# Altium schematic sheet MCH_CON.SchDoc: Metlino
size 420 x 297 mm; CheckedBy: P.Kulik,T.Przywozki,W.Ruclo; Author: G.Kasprowicz; CompanyName: WUT ISE; DrawnBy: G.Kasprowicz; Organization: WUT ISE; Address1: PW ISE; Address2: Nowowiejska 15/19 00-665 Warsaw; Address3: gkasprow@gmail.com; DocumentNumber: 15; Revision: 2; SheetNumber: 15; SheetTotal: 29; ModifiedBy: -; CheckedDate: -; Title2: MCH Tongue 3&4 connectors; DivGrp: WUT ISE; Designer: G.Kasprowicz; ModifiedDate: -; ProjectName: Sensor Box
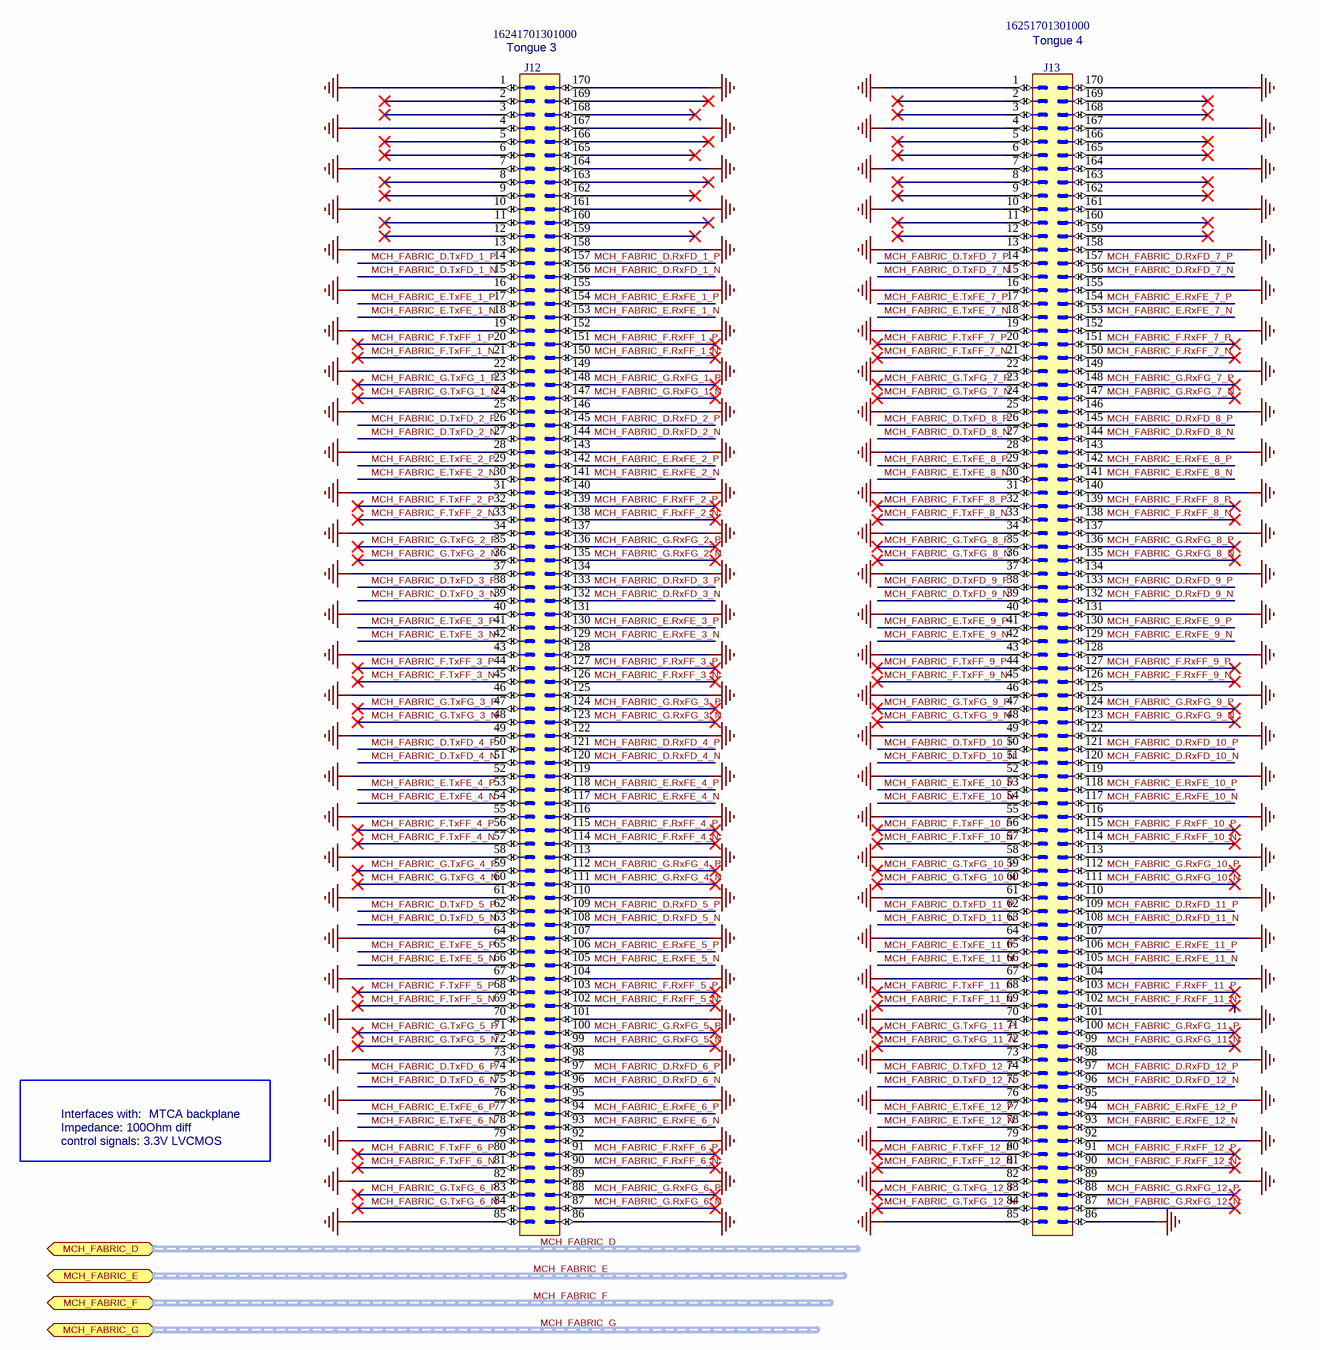
[diagram p0: MCH_CON.SchDoc]

## Parts
J12  Manufacturer Part Number: 16241701301000  [ITB_16241701301000]  (hidden comment: AdvancedMC)
J13  Manufacturer Part Number: 16251701301000  [ITB_16251701301000]  (hidden comment: AdvancedMC)

## Ports
MCH_FABRIC_D (bidir, harness MCH_FABRIC_D), MCH_FABRIC_E (bidir, harness MCH_FABRIC_E), MCH_FABRIC_F (bidir, harness MCH_FABRIC_F), MCH_FABRIC_G (bidir, harness MCH_FABRIC_G)

## Nets
GND: J12.1 J12.4 J12.7 J12.10 J12.13 J12.16 J12.19 J12.22 J12.25 J12.28 J12.31 J12.34 J12.37 J12.40 J12.43 J12.46 J12.49 J12.52 J12.55 J12.58 J12.61 J12.64 J12.67 J12.70 J12.73 J12.76 J12.79 J12.82 J12.85 J12.86 J12.89 J12.92 J12.95 J12.98 J12.101 J12.104 J12.107 J12.110 J12.113 J12.116 J12.119 J12.122 J12.125 J12.128 J12.131 J12.134 J12.137 J12.140 J12.143 J12.146 J12.149 J12.152 J12.155 J12.158 J12.161 J12.164 J12.167 J12.170 J13.1 J13.4 J13.7 J13.10 J13.13 J13.16 J13.19 J13.22 J13.25 J13.28 J13.31 J13.34 J13.37 J13.40 J13.43 J13.46 J13.49 J13.52 J13.55 J13.58 J13.61 J13.64 J13.67 J13.70 J13.73 J13.76 J13.79 J13.82 J13.85 J13.86 J13.89 J13.92 J13.95 J13.98 J13.101 J13.104 J13.107 J13.110 J13.113 J13.116 J13.119 J13.122 J13.125 J13.128 J13.131 J13.134 J13.137 J13.140 J13.143 J13.146 J13.149 J13.152 J13.155 J13.158 J13.161 J13.164 J13.167 J13.170
MCH_FABRIC_D.RxFD_1_N: J12.156
MCH_FABRIC_D.RxFD_1_P: J12.157
MCH_FABRIC_D.RxFD_2_N: J12.144
MCH_FABRIC_D.RxFD_2_P: J12.145
MCH_FABRIC_D.RxFD_3_N: J12.132
MCH_FABRIC_D.RxFD_3_P: J12.133
MCH_FABRIC_D.RxFD_4_N: J12.120
MCH_FABRIC_D.RxFD_4_P: J12.121
MCH_FABRIC_D.RxFD_5_N: J12.108
MCH_FABRIC_D.RxFD_5_P: J12.109
MCH_FABRIC_D.RxFD_6_N: J12.96
MCH_FABRIC_D.RxFD_6_P: J12.97
MCH_FABRIC_D.RxFD_7_N: J13.156
MCH_FABRIC_D.RxFD_7_P: J13.157
MCH_FABRIC_D.RxFD_8_N: J13.144
MCH_FABRIC_D.RxFD_8_P: J13.145
MCH_FABRIC_D.RxFD_9_N: J13.132
MCH_FABRIC_D.RxFD_9_P: J13.133
MCH_FABRIC_D.RxFD_10_N: J13.120
MCH_FABRIC_D.RxFD_10_P: J13.121
MCH_FABRIC_D.RxFD_11_N: J13.108
MCH_FABRIC_D.RxFD_11_P: J13.109
MCH_FABRIC_D.RxFD_12_N: J13.96
MCH_FABRIC_D.RxFD_12_P: J13.97
MCH_FABRIC_D.TxFD_1_N: J12.15
MCH_FABRIC_D.TxFD_1_P: J12.14
MCH_FABRIC_D.TxFD_2_N: J12.27
MCH_FABRIC_D.TxFD_2_P: J12.26
MCH_FABRIC_D.TxFD_3_N: J12.39
MCH_FABRIC_D.TxFD_3_P: J12.38
MCH_FABRIC_D.TxFD_4_N: J12.51
MCH_FABRIC_D.TxFD_4_P: J12.50
MCH_FABRIC_D.TxFD_5_N: J12.63
MCH_FABRIC_D.TxFD_5_P: J12.62
MCH_FABRIC_D.TxFD_6_N: J12.75
MCH_FABRIC_D.TxFD_6_P: J12.74
MCH_FABRIC_D.TxFD_7_N: J13.15
MCH_FABRIC_D.TxFD_7_P: J13.14
MCH_FABRIC_D.TxFD_8_N: J13.27
MCH_FABRIC_D.TxFD_8_P: J13.26
MCH_FABRIC_D.TxFD_9_N: J13.39
MCH_FABRIC_D.TxFD_9_P: J13.38
MCH_FABRIC_D.TxFD_10_N: J13.51
MCH_FABRIC_D.TxFD_10_P: J13.50
MCH_FABRIC_D.TxFD_11_N: J13.63
MCH_FABRIC_D.TxFD_11_P: J13.62
MCH_FABRIC_D.TxFD_12_N: J13.75
MCH_FABRIC_D.TxFD_12_P: J13.74
MCH_FABRIC_E.RxFE_1_N: J12.153
MCH_FABRIC_E.RxFE_1_P: J12.154
MCH_FABRIC_E.RxFE_2_N: J12.141
MCH_FABRIC_E.RxFE_2_P: J12.142
MCH_FABRIC_E.RxFE_3_N: J12.129
MCH_FABRIC_E.RxFE_3_P: J12.130
MCH_FABRIC_E.RxFE_4_N: J12.117
MCH_FABRIC_E.RxFE_4_P: J12.118
MCH_FABRIC_E.RxFE_5_N: J12.105
MCH_FABRIC_E.RxFE_5_P: J12.106
MCH_FABRIC_E.RxFE_6_N: J12.93
MCH_FABRIC_E.RxFE_6_P: J12.94
MCH_FABRIC_E.RxFE_7_N: J13.153
MCH_FABRIC_E.RxFE_7_P: J13.154
MCH_FABRIC_E.RxFE_8_N: J13.141
MCH_FABRIC_E.RxFE_8_P: J13.142
MCH_FABRIC_E.RxFE_9_N: J13.129
MCH_FABRIC_E.RxFE_9_P: J13.130
MCH_FABRIC_E.RxFE_10_N: J13.117
MCH_FABRIC_E.RxFE_10_P: J13.118
MCH_FABRIC_E.RxFE_11_N: J13.105
MCH_FABRIC_E.RxFE_11_P: J13.106
MCH_FABRIC_E.RxFE_12_N: J13.93
MCH_FABRIC_E.RxFE_12_P: J13.94
MCH_FABRIC_E.TxFE_1_N: J12.18
MCH_FABRIC_E.TxFE_1_P: J12.17
MCH_FABRIC_E.TxFE_2_N: J12.30
MCH_FABRIC_E.TxFE_2_P: J12.29
MCH_FABRIC_E.TxFE_3_N: J12.42
MCH_FABRIC_E.TxFE_3_P: J12.41
MCH_FABRIC_E.TxFE_4_N: J12.54
MCH_FABRIC_E.TxFE_4_P: J12.53
MCH_FABRIC_E.TxFE_5_N: J12.66
MCH_FABRIC_E.TxFE_5_P: J12.65
MCH_FABRIC_E.TxFE_6_N: J12.78
MCH_FABRIC_E.TxFE_6_P: J12.77
MCH_FABRIC_E.TxFE_7_N: J13.18
MCH_FABRIC_E.TxFE_7_P: J13.17
MCH_FABRIC_E.TxFE_8_N: J13.30
MCH_FABRIC_E.TxFE_8_P: J13.29
MCH_FABRIC_E.TxFE_9_N: J13.42
MCH_FABRIC_E.TxFE_9_P: J13.41
MCH_FABRIC_E.TxFE_10_N: J13.54
MCH_FABRIC_E.TxFE_10_P: J13.53
MCH_FABRIC_E.TxFE_11_N: J13.66
MCH_FABRIC_E.TxFE_11_P: J13.65
MCH_FABRIC_E.TxFE_12_N: J13.78
MCH_FABRIC_E.TxFE_12_P: J13.77
MCH_FABRIC_F.RxFF_1_N: J12.150
MCH_FABRIC_F.RxFF_1_P: J12.151
MCH_FABRIC_F.RxFF_2_N: J12.138
MCH_FABRIC_F.RxFF_2_P: J12.139
MCH_FABRIC_F.RxFF_3_N: J12.126
MCH_FABRIC_F.RxFF_3_P: J12.127
MCH_FABRIC_F.RxFF_4_N: J12.114
MCH_FABRIC_F.RxFF_4_P: J12.115
MCH_FABRIC_F.RxFF_5_N: J12.102
MCH_FABRIC_F.RxFF_5_P: J12.103
MCH_FABRIC_F.RxFF_6_N: J12.90
MCH_FABRIC_F.RxFF_6_P: J12.91
MCH_FABRIC_F.RxFF_7_N: J13.150
MCH_FABRIC_F.RxFF_7_P: J13.151
MCH_FABRIC_F.RxFF_8_N: J13.138
MCH_FABRIC_F.RxFF_8_P: J13.139
MCH_FABRIC_F.RxFF_9_N: J13.126
MCH_FABRIC_F.RxFF_9_P: J13.127
MCH_FABRIC_F.RxFF_10_N: J13.114
MCH_FABRIC_F.RxFF_10_P: J13.115
MCH_FABRIC_F.RxFF_11_N: J13.102
MCH_FABRIC_F.RxFF_11_P: J13.103
MCH_FABRIC_F.RxFF_12_N: J13.90
MCH_FABRIC_F.RxFF_12_P: J13.91
MCH_FABRIC_F.TxFF_1_N: J12.21
MCH_FABRIC_F.TxFF_1_P: J12.20
MCH_FABRIC_F.TxFF_2_N: J12.33
MCH_FABRIC_F.TxFF_2_P: J12.32
MCH_FABRIC_F.TxFF_3_N: J12.45
MCH_FABRIC_F.TxFF_3_P: J12.44
MCH_FABRIC_F.TxFF_4_N: J12.57
MCH_FABRIC_F.TxFF_4_P: J12.56
MCH_FABRIC_F.TxFF_5_N: J12.69
MCH_FABRIC_F.TxFF_5_P: J12.68
MCH_FABRIC_F.TxFF_6_N: J12.81
MCH_FABRIC_F.TxFF_6_P: J12.80
MCH_FABRIC_F.TxFF_7_N: J13.21
MCH_FABRIC_F.TxFF_7_P: J13.20
MCH_FABRIC_F.TxFF_8_N: J13.33
MCH_FABRIC_F.TxFF_8_P: J13.32
MCH_FABRIC_F.TxFF_9_N: J13.45
MCH_FABRIC_F.TxFF_9_P: J13.44
MCH_FABRIC_F.TxFF_10_N: J13.57
MCH_FABRIC_F.TxFF_10_P: J13.56
MCH_FABRIC_F.TxFF_11_N: J13.69
MCH_FABRIC_F.TxFF_11_P: J13.68
MCH_FABRIC_F.TxFF_12_N: J13.81
MCH_FABRIC_F.TxFF_12_P: J13.80
MCH_FABRIC_G.RxFG_1_N: J12.147
MCH_FABRIC_G.RxFG_1_P: J12.148
MCH_FABRIC_G.RxFG_2_N: J12.135
MCH_FABRIC_G.RxFG_2_P: J12.136
MCH_FABRIC_G.RxFG_3_N: J12.123
MCH_FABRIC_G.RxFG_3_P: J12.124
MCH_FABRIC_G.RxFG_4_N: J12.111
MCH_FABRIC_G.RxFG_4_P: J12.112
MCH_FABRIC_G.RxFG_5_N: J12.99
MCH_FABRIC_G.RxFG_5_P: J12.100
MCH_FABRIC_G.RxFG_6_N: J12.87
MCH_FABRIC_G.RxFG_6_P: J12.88
MCH_FABRIC_G.RxFG_7_N: J13.147
MCH_FABRIC_G.RxFG_7_P: J13.148
MCH_FABRIC_G.RxFG_8_N: J13.135
MCH_FABRIC_G.RxFG_8_P: J13.136
MCH_FABRIC_G.RxFG_9_N: J13.123
MCH_FABRIC_G.RxFG_9_P: J13.124
MCH_FABRIC_G.RxFG_10_N: J13.111
MCH_FABRIC_G.RxFG_10_P: J13.112
MCH_FABRIC_G.RxFG_11_N: J13.99
MCH_FABRIC_G.RxFG_11_P: J13.100
MCH_FABRIC_G.RxFG_12_N: J13.87
MCH_FABRIC_G.RxFG_12_P: J13.88
MCH_FABRIC_G.TxFG_1_N: J12.24
MCH_FABRIC_G.TxFG_1_P: J12.23
MCH_FABRIC_G.TxFG_2_N: J12.36
MCH_FABRIC_G.TxFG_2_P: J12.35
MCH_FABRIC_G.TxFG_3_N: J12.48
MCH_FABRIC_G.TxFG_3_P: J12.47
MCH_FABRIC_G.TxFG_4_N: J12.60
MCH_FABRIC_G.TxFG_4_P: J12.59
MCH_FABRIC_G.TxFG_5_N: J12.72
MCH_FABRIC_G.TxFG_5_P: J12.71
MCH_FABRIC_G.TxFG_6_N: J12.84
MCH_FABRIC_G.TxFG_6_P: J12.83
MCH_FABRIC_G.TxFG_7_N: J13.24
MCH_FABRIC_G.TxFG_7_P: J13.23
MCH_FABRIC_G.TxFG_8_N: J13.36
MCH_FABRIC_G.TxFG_8_P: J13.35
MCH_FABRIC_G.TxFG_9_N: J13.48
MCH_FABRIC_G.TxFG_9_P: J13.47
MCH_FABRIC_G.TxFG_10_N: J13.60
MCH_FABRIC_G.TxFG_10_P: J13.59
MCH_FABRIC_G.TxFG_11_N: J13.72
MCH_FABRIC_G.TxFG_11_P: J13.71
MCH_FABRIC_G.TxFG_12_N: J13.84
MCH_FABRIC_G.TxFG_12_P: J13.83

Not connected (* = marked no-connect by the designer): J12 2(3)* 3(5)* 5(9)* 6(11)* 8(15)* 9(17)* 11(21)* 12(23)* 159* 160* 162* 163* 165* 166* 168* 169*; J13 2(3)* 3(5)* 5(9)* 6(11)* 8(15)* 9(17)* 11(21)* 12(23)* 159* 160* 162* 163* 165* 166* 168* 169*

## Buses and harness runs
harness MCH_FABRIC_D = port MCH_FABRIC_D
harness MCH_FABRIC_E = port MCH_FABRIC_E
harness MCH_FABRIC_F = port MCH_FABRIC_F
harness MCH_FABRIC_G = port MCH_FABRIC_G

## Notes on the sheet
- (near J12) Tongue 3
- (near J13) Tongue 4
- Interfaces with:
- MTCA backplane
- control signals: 3.3V LVCMOS
- Impedance: 100Ohm diff
- Project/Equipment
- Document
- Designer
- Drawn by
- Check.by
- Copyright WUT ISE 2018.
  This documentation describes Open Hardware and is licensed under the CERN OHL v.1.1. You may redistribute and modify this documentation under the terms of the CERN OHL v.1.1. (http://ohwr.org/CERNOHL). This documentation is distributed WITHOUT ANY EXPRESS OR IMPLIED WARRANTY, INCLUDING OF MERCHANTABILITY, SATISFACTORY QUALITY AND FITNESS FOR A PARTICULAR PURPOSE. Please see the CERN OHL v.1.1 for applicable conditions.
- Contact
- File
- Last Mod.
- Print Date
- Sheet
- Size
- A3
- of
- Rev

## Library data of the parts
J12 = ITB_16241701301000: Connector 170 Male; Manufacturer: ITB ADVANCED CONNECTORS; Part Description: 170 Poles, MCH-Plug Connector (Basic Side); PressFit: No; Part Number: ITB_16241701301000; Component Kind: Standard; Component Type: Standard; Pin Count: 170; Family: AdvancedMC; Mounted: Yes; Socket: No; SMD: No; Sense: No; Status: None; ComponentHeight: 7.63mm; HelpURL: \\cern.ch\dfs\Applications\Altium\Datasheets\ITB_16241701301000.pdf; Author: CERN DEM MR; CreateDate: 17.05.2016; LatestRevisionDate: 17.05.2016
J13 = ITB_16251701301000: Connector 170 Male; Manufacturer: ITB ADVANCED CONNECTORS; Part Description: 170 Poles, Piggyback Plug Connector (Basic Side); PressFit: No; Part Number: ITB_16251701301000; Component Kind: Standard; Component Type: Standard; Pin Count: 170; Family: AdvancedMC; Mounted: Yes; Socket: No; SMD: No; Sense: No; Status: None; ComponentHeight: 7.64mm; HelpURL: \\cern.ch\dfs\Applications\Altium\Datasheets\ITB_16251701301000.pdf; Author: CERN DEM MR; CreateDate: 17.05.2016; LatestRevisionDate: 17.05.2016